# Altium project PaulInOne.PrjPcb
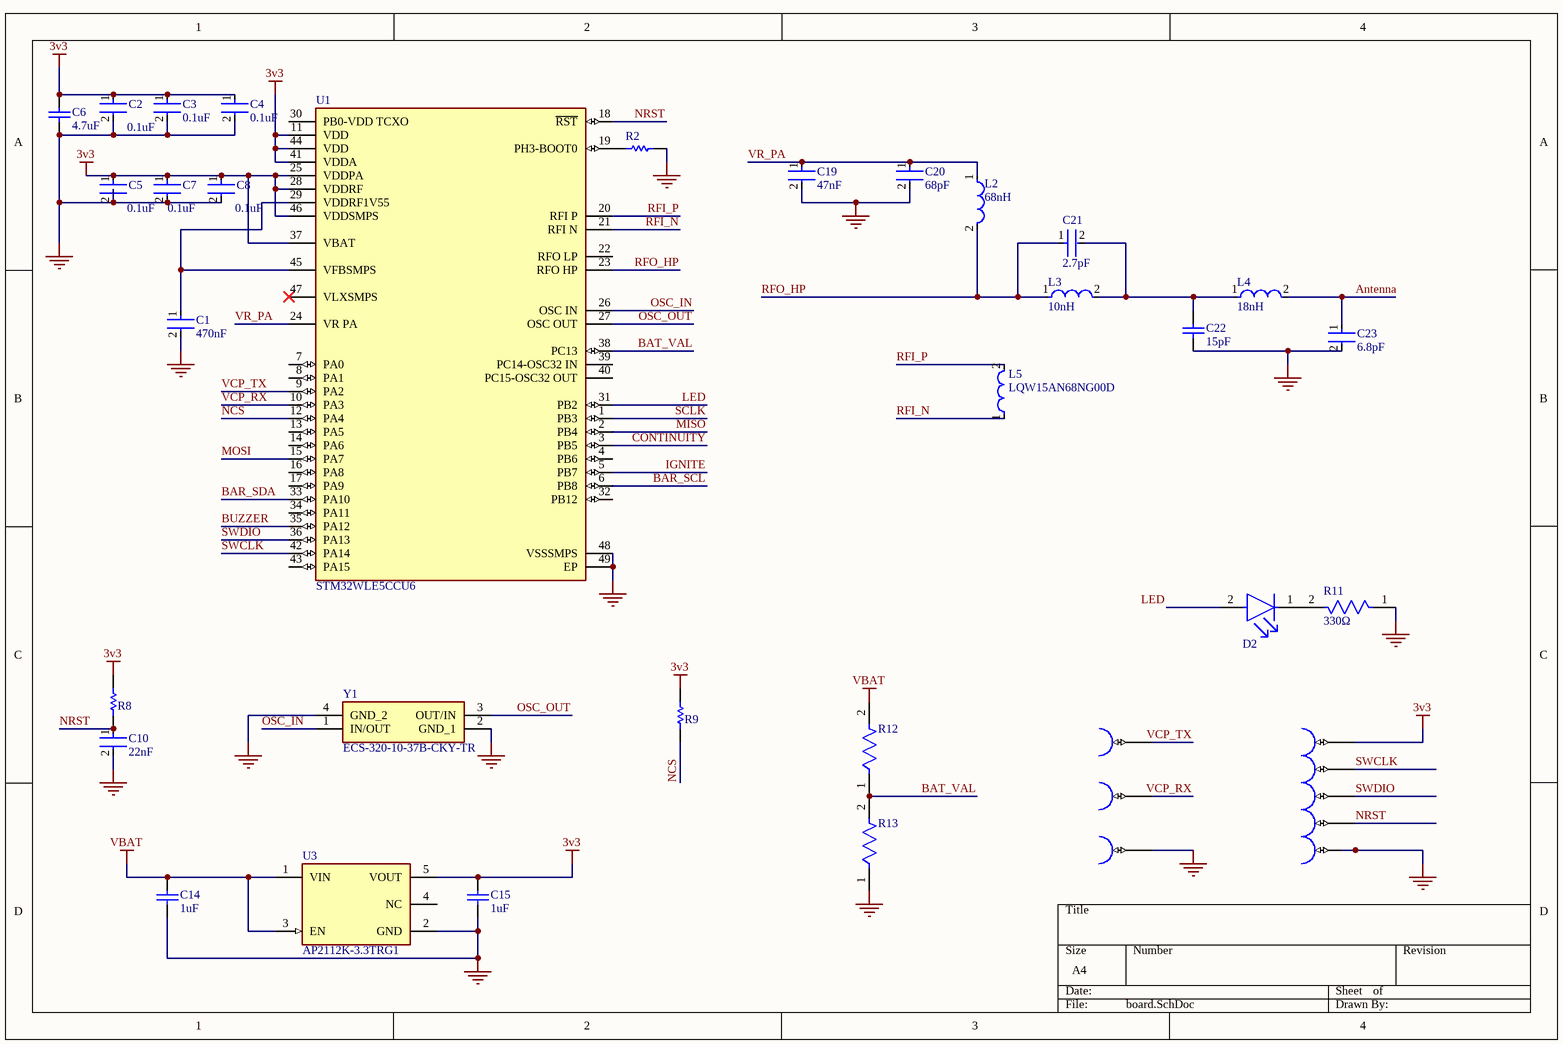
[diagram p0: board.SchDoc]
2 sheets, 56 parts. Net scope: global (net labels, ports and power ports of the same name join across sheets).
Board file: PCB_design.PcbDoc
Sheets:
  board.SchDoc
  MISC.SchDoc

## Sheet board.SchDoc
size A4; SheetNumber: 1; SheetTotal: 2

### Parts
C1  470nF  [FP-C0603C-CF-MFG]
C2  0.1uF  [FP-C0402-BB-MFG]
C3  0.1uF  [FP-C0402-BB-MFG]
C4  0.1uF  [FP-C0402-BB-MFG]
C5  0.1uF  [FP-C0402-BB-MFG]
C6  4.7uF  [CAPC1608X87X35NL15T15]
C7  0.1uF  [FP-C0402-BB-MFG]
C8  0.1uF  [FP-C0402-BB-MFG]
C10  22nF  [FP-C0402-BB-MFG]
C14  1uF  [C0603]
C15  1uF  [C0603]
C19  47nF  [FP-CC0402-MFG]
C20  68pF  [FP-C0402-BB-MFG]
C21  2.7pF  [FP-GJM155-0_05-IPC_A]
C22  15pF  [CAPC1005X55X25NL05T10]
C23  6.8pF  [FP-C0402-BB-MFG]
D2  LTST-C190GKT  [FP-LTST-C190GKT-MFG]  (value not drawn)
L2  68nH  [FP-LQW15AN_00-W0_5-0_1-MFG]
L3  10nH  [FP-LQW15AN_00-W0_6-0_1-MFG]
L4  18nH  [FP-LQW15AN_00-W0_6-0_1-MFG]
L5  LQW15AN68NG00D  [FP-LQW15AN_00-W0_5-0_1-MFG]
R2  ERJ2RKF1002X  [RESC1005X40X25LL05T05]  (value not drawn)
R8  ERJ2RKF1002X  [RESC1005X40X25LL05T05]  (value not drawn)
R9  ERJ3EKF1002V  [RESC1609X55X30LL15T15]  (value not drawn)
R11  330Ω  [FP-CRCW0402-e3-IPC_C]
R12  CRCW0402100KFKED  [FP-CRCW0402-e3-IPC_C]  (value not drawn)
R13  CRCW040250K0FKED  [FP-CRCW0402-e3-IPC_A]  (value not drawn)
TP1  Castellated Hole  [Castellated Hole]  (value not drawn)
TP2  Castellated Hole  [Castellated Hole]  (value not drawn)
TP3  Castellated Hole  [Castellated Hole]  (value not drawn)
TP4  Castellated Hole  [Castellated Hole]  (value not drawn)
TP5  Castellated Hole  [Castellated Hole]  (value not drawn)
TP6  Castellated Hole  [Castellated Hole]  (value not drawn)
TP7  Castellated Hole  [Castellated Hole]  (value not drawn)
TP8  Castellated Hole  [Castellated Hole]  (value not drawn)
U1  STM32WLE5CCU6  [FP-UFQFPN48-A0B9-IPC_C]
U3  AP2112K-3.3TRG1  [FP-SOT25-IPC_A]
Y1  ECS-320-10-37B-CKY-TR  [ECS3201037BCKYTR]

### Nets
3v3: C2.1 C3.1 C4.1 C5.1 C6.2 C7.1 C8.1 C15.2 R8.2 R9.2 TP1.1(Pin) U1.11(VDD) U1.25(VDDPA) U1.28(VDDRF) U1.37(VBAT) U1.41(VDDA) U1.44(VDD) U1.46(VDDSMPS) U3.5(VOUT)
GND: C1.2 C2.2 C3.2 C4.2 C5.2 C6.1 C7.2 C8.2 C10.2 C14.1 C15.1 C19.2 C20.2 C22.1 C23.2 R2.2 R11.1 R13.1 TP5.1(Pin) TP8.1(Pin) U1.48(VSSSMPS) U1.49(EP) U3.2(GND) Y1.2(GND_1) Y1.4(GND_2)
VBAT: C14.2 R12.2 U3.1(VIN) U3.3(EN)
Antenna: C23.1 L4.2
BAR_SCL: U1.6(PB8)
BAR_SDA: U1.33(PA10)
BAT_VAL: R12.1 R13.2 U1.38(PC13)
BUZZER: U1.35(PA12)
CONTINUITY: U1.3(PB5)
IGNITE: U1.5(PB7)
LED: D2.2(A) U1.31(PB2)
MISO: U1.2(PB4)
MOSI: U1.15(PA7)
NCS: R9.1 U1.12(PA4)
NRST: C10.1 R8.1 TP4.1(Pin) U1.18(~{RST})
OSC_IN: U1.26(OSC_IN) Y1.1(IN/OUT)
OSC_OUT: U1.27(OSC_OUT) Y1.3(OUT/IN)
RFI_N: L5.1 U1.21(RFI_N)
RFI_P: L5.2 U1.20(RFI_P)
RFO_HP: C21.1 L2.2 L3.1 U1.23(RFO_HP)
SCLK: U1.1(PB3)
SWCLK: TP2.1(Pin) U1.42(PA14)
SWDIO: TP3.1(Pin) U1.36(PA13)
VCP_RX: TP7.1(Pin) U1.10(PA3)
VCP_TX: TP6.1(Pin) U1.9(PA2)
VR_PA: C19.1 C20.1 L2.1 U1.24(VR_PA)
NetC1_1: C1.1 U1.29(VDDRF1V55) U1.45(VFBSMPS)
NetC21_2: C21.2 C22.2 L3.2 L4.1
NetD2_1: D2.1(C) R11.2
NetR2_1: R2.1 U1.19(PH3-BOOT0)

Not connected (* = marked no-connect by the designer): U1 4(PB6) 7(PA0) 8(PA1) 13(PA5) 14(PA6) 16(PA8) 17(PA9) 22(RFO_LP) 30(PB0-VDD_TCXO) 32(PB12) 34(PA11) 39(PC14-OSC32_IN) 40(PC15-OSC32_OUT) 43(PA15) 47(VLXSMPS)*; U3 4(NC)

### Library data of the parts
C1 = CMP-2006-03235-2: CAP CER 0.47UF 16V X7R 0603; Manufacturer Part Number: C0603C474K4RACTU; Manufacturer: KEMET; Automotive Grade: Grade 1; Value: 0.47 μF; Tolerance: 0.1; Temperature Coefficient: 30ppm/°C; Material: Ceramic; Device Class L3: Ceramic Capacitors; ComponentLink2URL: https://api.kemet.com/component-edge/download/datasheet/C0603C100J5GACAUTO.pdf; Height: 0.87mm; ComponentLink2Description: Datasheet; Device Class L2: Capacitors; Temperature Range Low: -55°C; Temperature Range High: +125°C; RoHS: TRUE; Mouser Description: 0603 C 470nF Ceramic Multilayer Capacitor, 16 V, +125degC, X7R Dielec, +/-10%; Temperature Characteristic: X7R; Digikey Description: CAP CER 0.47UF 16V X7R 0603; Lead Free: Yes; Automotive: Yes; Octopart: https://octopart.com/c0603c474k4ractu-kemet-109683; Capacitance: 0.47 μF; Package: C0603C-CF; Voltage Rating: 16 V; Device Class L1: Passive Components; Category: Cap; Temperature: -55°C to +125°C
C2-C5 C7 C8 = CMP-2008-02046-2: CAP CER 0.1UF 10V X5R 0402; Manufacturer: Kemet; Manufacturer Part Number: C0402C104K8PACTU; Material: Ceramic; Capacitance: 0.10 μF; Temperature Coefficient: 15%; Tolerance: 0.1; Value: 0.10 μF; Package: C0402-BB; Temperature: -55°C to +125°C; ComponentLink2Description: Datasheet; Temperature Characteristic: X5R; Device Class L1: Passive Components; Height: 0.55mm; Lead Free: Yes; ComponentLink2URL: https://content.kemet.com/datasheets/KEM_C1002_X7R_SMD.pdf; Device Class L2: Capacitors; Temperature Range Low: -55°C; Temperature Range High: +125°C; RoHS: TRUE; Octopart: https://octopart.com/c0402c104k8pactu-kemet-140039; Automotive: No; Mouser Description: Capacitor 100 nF 10 VDC 0402; Category: Cap; Voltage Rating: 10 V; Digikey Description: CAP CER 0.1UF 10V X5R 0402; Ipc Land Pattern Name: CAPC10050X50; Device Class L3: Ceramic Capacitors
C6 = CMP-2006-03238-1: Part Number: C0603C475K8PACTU; Manufacturer: Kemet
C10 = CMP-2008-03151-2: CAP CER 0.022UF 50V 10% X7R 0402; Manufacturer Part Number: C0402C223K5RACTU; Manufacturer: Kemet; Tolerance: 0.1; Temperature Coefficient: 15%; Capacitance: 22,000 pF; Material: Ceramic; Value: 22,000 pF; Lead Free: Yes; ComponentLink2URL: https://content.kemet.com/datasheets/KEM_C1002_X7R_SMD.pdf; Category: Cap; Digikey Description: CAP CER 0.022UF 50V 10% X7R 0402; Mouser Description: 0402 C 22nF Ceramic Multilayer Capacitor, 50 V, +125degC, X7R Dielectric, +/-10%; Temperature: -55°C to +125°C; Temperature Range High: +125°C; Device Class L3: Ceramic Capacitors; Device Class L1: Passive Components; Height: 0.55mm; Package: C0402-BB; Octopart: https://octopart.com/c0402c223k5ractu-kemet-99241; Temperature Range Low: -55°C; Voltage Rating: 50 V; Ipc Land Pattern Name: CAPC10050X50; ComponentLink2Description: Datasheet; Automotive: No; Temperature Characteristic: X7R; RoHS: TRUE; Device Class L2: Capacitors
C14 C15 = CMP-00121-2: CAP CER 1UF 50V X7R 0603; Made by: Victor Gutierrez; Design Item ID: CC0603KRX7R9BB105; Source: Capacitors.SchLib
C19 = CMP-03422-000813-1: CAP CER 0.047UF 25V X7R 0402; Manufacturer Part Number: CC0402KRX7R8BB473; Manufacturer: YAGEO; Automotive Grade: NA; Temperature Coefficient: 30ppm/°C; Material: Ceramic; Tolerance: 0.1; Temperature: -55°C to +125°C; Category: Cap; Voltage Rating: 25 V; Digikey Description: CAP CER 0.047UF 25V X7R 0402; Device Class L1: Passive Components; Device Class L3: Ceramic Capacitors; Ipc Land Pattern Name: CAPC10050X50; Value: 47 nF; Temperature Characteristic: X7R; Temperature Range High: +125°C; ComponentLink2URL: http://www.yageo.com/documents/recent/UPY-GP_NP0_16V-to-50V_16.pdf; Automotive: No; Temperature Range Low: -55°C; Package: CC0402; RoHS: TRUE; Height: 0.55mm; Device Class L2: Capacitors; Capacitance: 47 nF; Octopart: https://octopart.com/cc0402krx7r8bb473-yageo-22850998; Lead Free: Yes; Mouser Description: Multilayer Ceramic Capacitors MLCC - SMD/SMT 47nF 25V X7R 10%; Footprint Url: http://www.yageo.com/exep/pages/download/literatures/UPY-C_GEN_24.pdf; ComponentLink2Description: Datasheet
C20 = CMP-1034-01170-4: CAP CER 68PF 50V 5% NP0 0402; Manufacturer: Kemet; Manufacturer Part Number: C0402C680J5GACTU; Temperature Coefficient: 15%; Tolerance: 0.05; Temperature Characteristic: C0G; Material: Ceramic; Mouser Description: Multilayer Ceramic Capacitors MLCC - SMD/SMT 50volts 68pF C0G 5%; Package: C0402-BB; Automotive: No; Temperature: -55°C to +125°C; RoHS: TRUE; Category: Cap; Capacitance: 68 pF; Value: 68 pF; Height: 0.55mm; Lead Free: Yes; Device Class L1: Passive Components; Voltage Rating: 50 V; Device Class L2: Capacitors; Device Class L3: Ceramic Capacitors; ComponentLink2Description: Datasheet; Temperature Range High: +125°C; Octopart: https://octopart.com/c0402c680j5gactu-kemet-127205; ComponentLink2URL: https://content.kemet.com/datasheets/KEM_C1002_X7R_SMD.pdf; Digikey Description: CAP CER 68PF 50V 5% NP0 0402; Temperature Range Low: -55°C; Ipc Land Pattern Name: CAPC10050X50
C21 = CMP-2008-03840-2: Multi-Layer Ceramic Capacitor 2.7pF C0G  ±0.1pF 0402 Paper T/R; Voltage Rating (DC): 50V; Temperature Coefficient: 30ppm/°C; Max Operating Temperature: 125°C; Lead Free: Lead Free; REACH SVHC: No SVHC; Thickness: 0.022inch; Length: 1mm; Height: 0.5mm; Min Operating Temperature: -55°C; Mount: Surface Mount; Case/Package: 0402; Case Code (Imperial): 0402; Width: 0.02inch; Capacitance: 2.7pF; Packaging: Tape and Reel; Package Quantity: 10000; Lead Pitch: 0.3mm; Dielectric: C0G; Depth: 0.5mm; Voltage Rating: 50V; Radiation Hardening: No; Termination: SMD/SMT; Voltage: 50V; Number of Pins: 2; Case Code (Metric): 1005
C22 = CMP-2008-04267-1: Part Number: GRM1555C1H150JZ01D; Manufacturer: Murata
C23 = CMP-1034-00517-3: CAP CER 6.8PF 50V NP0 0402; Manufacturer: Kemet; Manufacturer Part Number: C0402C689C5GACTU; Material: Ceramic; Temperature Characteristic: C0G; Tolerance: 0.25 pF; Temperature Coefficient: 15%; ComponentLink2URL: https://content.kemet.com/datasheets/KEM_C1002_X7R_SMD.pdf; Octopart: https://octopart.com/c0402c689c5gactu-kemet-9143567; RoHS: TRUE; Temperature: -55°C to +125°C; Device Class L2: Capacitors; ComponentLink2Description: Datasheet; Mouser Description: Cap Ceramic 6.8pF 50V C0G 0.25pF SMD 0402 125°C Paper T/R; Device Class L3: Ceramic Capacitors; Digikey Description: CAP CER 6.8PF 50V NP0 0402; Temperature Range High: +125°C; Package: C0402-BB; Voltage Rating: 50 V; Height: 0.55mm; Ipc Land Pattern Name: CAPC10050X50; Value: 6.8 pF; Device Class L1: Passive Components; Category: Cap; Capacitance: 6.8 pF; Lead Free: Yes; Automotive: No; Temperature Range Low: -55°C
D2 = CMP-22017-000005-2: LED GREEN CLEAR CHIP SMD; Dominant Wavelength: 569nm; Reverse Voltage: 5V; Lens Color: Colorless; Viewing Angle: 130°; Voltage: 2V; Forward Current: 30mA; Power Dissipation: 100mW; Luminous Intensity: 6mcd; Number of LEDs: 1; Forward Voltage: 2.1V; Wavelength: 565nm; Test Current: 10mA; Min Operating Temperature: -55°C; Lens Style: Clear; Mount: Surface Mount; Width: 0.8mm; Packaging: Tape and Reel; Lens Transparency: Clear; Case Code (Metric): 1608; Depth: 0.8mm; Case Code (Imperial): 0603; Case/Package: 0603; Number of Pins: 2; Max Operating Temperature: 85°C; Lead Free: Lead Free; Number of Elements: 1; Length: 1.6mm; Height: 0.8mm; Package Quantity: 1; Power Rating: 100mW; Radiation Hardening: No; Illumination Color: Green; Color: Green
L2 L5 = CMP-06042-005746-1: Wire Wound RF Inductor 68nH ±2% 140mA 1.96Ω 0402 (1005); Core Material: Air; DC Resistance (DCR): 1.96R; Q Factor: 20; Shielding: Unshielded; Test Frequency: 100MHz; Current: 570mA; Self Resonant Frequency: 2.5GHz; Max Operating Temperature: 125°C; Depth: 0.6mm; Case Code (Metric): 1005; Tolerance: 2%; Weight: 2.8E-05oz; Width: 0.5mm; Case/Package: 0402; Termination: SMD/SMT; Height: 0.5mm; Lead Free: Lead Free; Mount: Surface Mount; Length: 1mm; Number of Pins: 2; Min Operating Temperature: -55°C; Inductance: 68nH; Case Code (Imperial): 0402; Packaging: Tape and Reel; Inductance Tolerance: 2%; Current Rating: 140mA; Package Quantity: 10000; DC Current: 140mA; Max DC Current: 140mA; Military Standard: Not; Radiation Hardening: No; REACH SVHC: No SVHC
L3 = CMP-06042-002082-1: Wire Wound RF Inductor 10nH ±2% 500mA 0.17Ω 0402 (1005); Shielding: Unshielded; DC Resistance (DCR): 170mR; Test Frequency: 100MHz; Current: 370mA; Core Material: Non-Magnetic; Self Resonant Frequency: 5.5GHz; Tolerance: 2%; Depth: 0.7mm; Lead Free: Lead Free; Termination: SMD/SMT; Case Code (Imperial): 0402; Height - Seated (Max): 0.024inch; Package Quantity: 10000; Packaging: Tape and Reel; Case/Package: 0402; REACH SVHC: No SVHC; Length: 1mm; Weight: 2.8E-05oz; Resistor Type: Wirewound; Number of Pins: 2; Mount: Surface Mount; DC Current: 500mA; Max Operating Temperature: 125°C; Case Code (Metric): 1005; Width: 0.02inch; Max DC Current: 500mA; Inductance: 10nH; Radiation Hardening: No; Height: 0.5mm; Current Rating: 500mA; Min Operating Temperature: -55°C; Military Standard: Not; Inductance Tolerance: 2%
L4 = CMP-06042-006916-1: Wire Wound RF Inductor 18nH ±5% 370mA 0.27Ω 0402 (1005); Q Factor: 25; DC Resistance (DCR): 270mR; Test Frequency: 100MHz; Self Resonant Frequency: 4.5GHz; Core Material: Air; Shielding: Unshielded; Inductance: 18nH; Lead Free: Lead Free; Resistor Type: Wirewound; Height: 0.5mm; Width: 0.02inch; Max DC Current: 370mA; Case/Package: 0402; Radiation Hardening: No; Min Operating Temperature: -55°C; Packaging: Tape and Reel; DC Current: 370mA; Tolerance: 5%; Max Operating Temperature: 125°C; Weight: 2.8E-05oz; Current Rating: 370mA; Military Standard: Not; Termination: SMD/SMT; Length: 1mm; Case Code (Metric): 1005; Mount: Surface Mount; Case Code (Imperial): 0402; Package Quantity: 10000; Depth: 0.7mm
R2 R8 = CMP-2000-07588-1: Chip Resistor, 10 KOhm, +/- 1%, 0.1 W, -55 to 155 degC, 0402 (1005 Metric), RoHS, Tape and Reel; Manufacturer: Panasonic; Power Rating: 100mW; Voltage Rating: 50V; Resistance: 10KOhm; Case\/Package: 0402; Temperature Coefficient: 100ppm\/degreesC; RoHSCompliant: True; Lead Free: LeadFree; Package Quantity: 1; Contact Plating: Tin; Length: 1mm; Radiation Hardening: No; REACH SVHC: NoSVHC; Max Operating Temperature: 155degC; Depth: 0.5mm; Case Code (Imperial): 0402; Military Standard: Not; Package Description: 2-Pin Surface Mount Device, Body 1 x 0.5 mm; Termination: SMD/SMT; Case Code (Metric): 1005; Height: 0.35mm; Packaging: TapeandReel; Voltage Rating (DC): 50V; Package Reference: 402; Number of Pins: 2; Tolerance: 1%; Mounting Technology: SurfaceMount; Width: 0.02inch; Mount: SurfaceMount; Datasheet URL: https://industrial.panasonic.com/cdbs/www-data/pdf/RDA0000/AOA0000C304.pdf; Composition: ThickFilm; Datasheet Version: 02/2017; Manufacturer URL: http://www.panasonic.com/; Max Power Dissipation: 100mW; Number of Terminations: 2; Min Operating Temperature: -55degC
R9 = CMP-1012-00623-3: Chip Resistor, 10 KOhm, +/- 1%, 0.1 W, -55 to 155 degC, 0603 (1608 Metric), RoHS, Tape and Reel; Manufacturer: Panasonic; Voltage Rating: 75V; Case\/Package: 0603; Power Rating: 100mW; Resistance: 10KOhm; Temperature Coefficient: 100ppm\/degreesC; Number of Pins: 2; Package Reference: 603; Depth: 0.8mm; Mount: SurfaceMount; Package Description: 2-Pin Surface Mount Device, Body 1.6 x 0.85 mm; Datasheet Version: 02/2017; Length: 1.6mm; Lead Free: LeadFree; Height: 0.45mm; Number of Terminations: 2; Max Power Dissipation: 100mW; Min Operating Temperature: -55degC; Datasheet URL: https://industrial.panasonic.com/cdbs/www-data/pdf/RDA0000/AOA0000C304.pdf; Termination: SMD/SMT; Case Code (Metric): 1608; Case Code (Imperial): 0603; Tolerance: 1%; Max Operating Temperature: 155degC; RoHSCompliant: true; Voltage Rating (DC): 75V; Radiation Hardening: No; Packaging: TapeandReel; Composition: ThickFilm; Mounting Technology: SurfaceMount; Manufacturer URL: http://www.panasonic.com/; Width: 0.031inch; REACH SVHC: NoSVHC; Contact Plating: Tin; Military Standard: Not; Package Quantity: 1
R11 = CMP-2002-08122-2: RES Thick Film, 0Ω, 0.063W, 0402; Tolerance: 5%; Max Power Dissipation: 63mW; Voltage Rating: 50V; Temperature Coefficient: 100ppm/°C; Resistance: 0mR; Contact Plating: Tin; Height: 0.35mm; Radiation Hardening: No; Features: Automotive AEC-Q200; Composition: Thick Film; Width: 0.5mm; Weight: 2.3E-05oz; Termination: SMD/SMT; Packaging: Tape and Reel; Mount: Surface Mount; Case Code (Metric): 1005; Military Standard: Not; Min Operating Temperature: -55°C; Number of Terminations: 2; Package Quantity: 1; Case Code (Imperial): 0402; Depth: 0.5mm; Max Operating Temperature: 155°C; Case/Package: 0402; Power Rating: 63mW; Lead Free: Lead Free; Voltage Rating (DC): 50V; Length: 1mm
R12 = CMP-2002-08123-3: RES Thick Film, 100kΩ, 1%, 0.063W, 100ppm/°C, 0402; Power Rating: 63mW; Resistance: 100kR; Voltage Rating (DC): 50V; Lead Free: Lead Free; Height: 0.35mm; Contact Plating: Tin; Min Operating Temperature: -55°C; Package Quantity: 10000; Case/Package: 0402; Temperature Coefficient: 100ppm/°C; Number of Terminations: 2; Packaging: Tape and Reel; Max Power Dissipation: 63mW; Case Code (Metric): 1005; Mount: Surface Mount; Width: 0.02inch; Termination: SMD/SMT; Length: 1mm; Number of Pins: 2; Weight: 2.3E-05oz; Radiation Hardening: No; Tolerance: 1%; Military Standard: Not; Features: Automotive AEC-Q200; Depth: 0.5mm; Composition: Thick Film; Max Operating Temperature: 155°C; Voltage Rating: 50V; Case Code (Imperial): 0402
R13 = CMP-02407-005152-1: RES Thick Film, 50kΩ, 1%, 0.063W, 100ppm/°C, 0402; Power Rating: 63mW; Voltage Rating: 50V; Resistance: 50kR; Package Quantity: 10000; Case/Package: 0402; Max Operating Temperature: 155°C; Case Code (Metric): 1005; Termination: SMD/SMT; Lead Free: Lead Free; Height: 0.35mm; Width: 0.5mm; Packaging: Tape and Reel; Min Operating Temperature: -55°C; Length: 1mm; Tolerance: 1%; Case Code (Imperial): 0402; Weight: 2.3E-05oz
TP1-TP8 = CMP-00124-3: Castellated Hole, 1 connection
U1 = CMP-12105-000100-1: MULTIPROTOCOL LPWAN 32-BIT ARM C
U3 = CMP-12756-000035-1: IC REG LINEAR 3.3V 600MA SOT25; Number of Regulators: 1; Output Type: Fixed; Polarity: Positive; Min Input Voltage: 2.5V; Max Input Voltage: 6V; Accuracy: 1.5%; Quiescent Current: 55uA; Dropout Voltage: 250mV; Min Operating Temperature: -40°C; Length: 3.1mm; Output Current: 600mA; Max Operating Temperature: 85°C; Package Quantity: 1; Output Voltage: 3.3V; Width: 1.7mm; Number of Outputs: 1; Packaging: Tape and Reel; Height: 1.3mm; Lead Free: Lead Free; Max Output Current: 600mA; Case/Package: SOT-23-5; Mount: Surface Mount; Number of Pins: 5
Y1 = ECS-320-10-37B-CKY-TR: Crystal or Oscillator; Manufacturer_Name: ECS; Datasheet Link: https://ecsxtal.com/store/pdf/ECX-1637B.pdf; Height: 0.5mm; Manufacturer_Part_Number: ECS-320-10-37B-CKY-TR; Mouser Part Number: 520-320-10-37B-CKYT; Mouser Price/Stock: https://www.mouser.co.uk/ProductDetail/ECS/ECS-320-10-37B-CKY-TR?qs=l7cgNqFNU1gltxVt%2FwcX%252Bw%3D%3D; Arrow Part Number: ECS-320-10-37B-CKY-TR; Arrow Price/Stock: https://www.arrow.com/en/products/ecs-320-10-37b-cky-tr/ecs-international?region=nac

## Sheet MISC.SchDoc
size A4; SheetNumber: 2; SheetTotal: 2
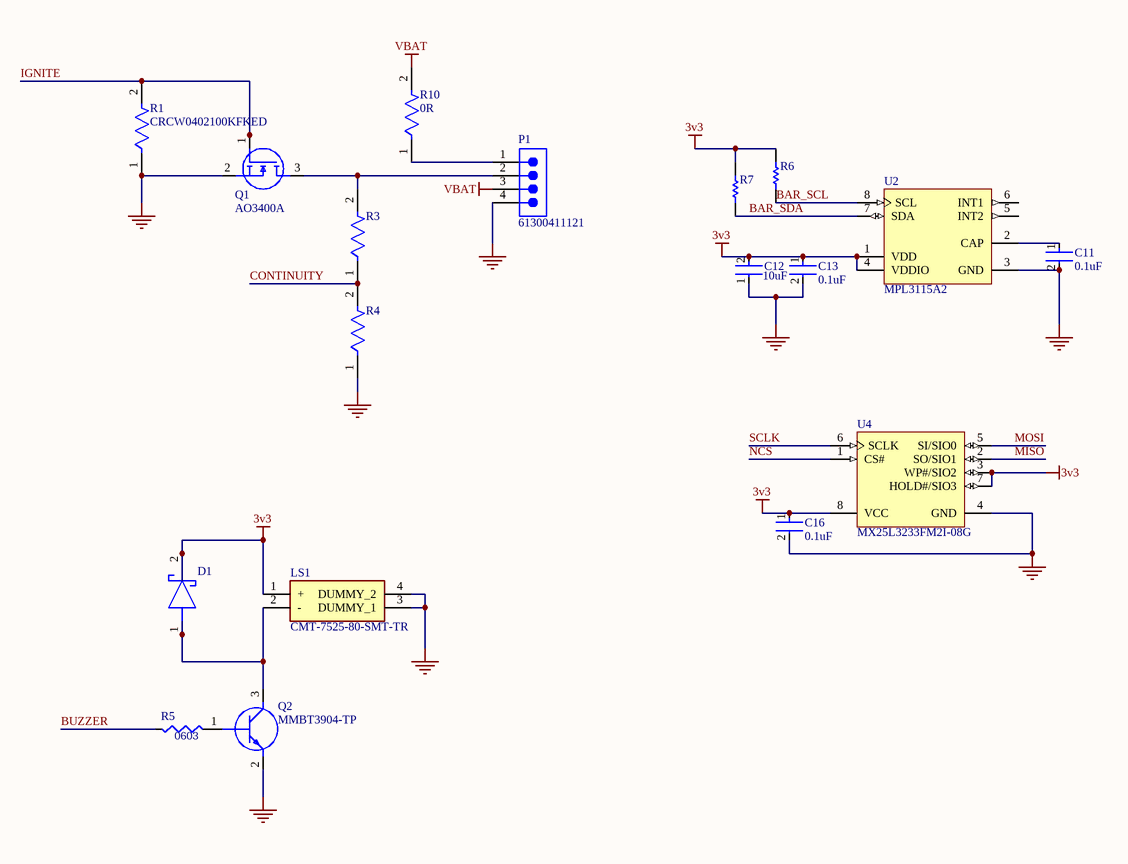
[diagram p1: MISC.SchDoc]

### Parts
C11  0.1uF  [FP-C0402-BB-MFG]
C12  10uF  [FP-C1608-080-0_1-MFG]
C13  0.1uF  [FP-C0402-BB-MFG]
C16  0.1uF  [FP-C0402-BB-MFG]
D1  RB161QS-40T18R  [RB161QS40T18R]  (value not drawn)
LS1  CMT-7525-80-SMT-TR  [CMT752580SMTTR]
P1  61300411121  [61300411121]
Q1  AO3400A  [SOT95P280X125-3N]
Q2  MMBT3904-TP  [SOT95P237X125-3N]
R1  CRCW0402100KFKED  [FP-CRCW0402-e3-IPC_C]
R3  CRCW0402100KFKED  [FP-CRCW0402-e3-IPC_C]  (value not drawn)
R4  CRCW040250K0FKED  [FP-CRCW0402-e3-IPC_A]  (value not drawn)
R5  ERJ-3EKF2000V  [R0603]  (value not drawn)
R6  RC0402JR-074K7L  [RESC1005X40X25LL05T10]  (value not drawn)
R7  RC0402JR-074K7L  [RESC1005X40X25LL05T10]  (value not drawn)
R10  0R  [FP-RK73Z1J-MFG]
U2  MPL3115A2  [FRES-2153-01_V]
U4  MX25L3233FM2I-08G  [MXIC-SOP-8_M]

### Nets
3v3: C12.2 C13.1 C16.1 D1.2(K) LS1.1(+) R6.2 R7.2 U2.1(VDD) U2.4(VDDIO) U4.3(WP#/SIO2) U4.7(HOLD#/SIO3) U4.8(VCC)
GND: C11.2 C12.1 C13.2 C16.2 LS1.3(DUMMY_1) LS1.4(DUMMY_2) P1.4 Q1.2(S) Q2.2(E) R1.1 R4.1 U2.3(GND) U4.4(GND)
VBAT: P1.3 R10.2
BAR_SCL: R6.1 U2.8(SCL)
BAR_SDA: R7.1 U2.7(SDA)
BUZZER: R5.1
CONTINUITY: R3.1 R4.2
IGNITE: Q1.1(G) R1.2
MISO: U4.2(SO/SIO1)
MOSI: U4.5(SI/SIO0)
NCS: U4.1(CS#)
SCLK: U4.6(SCLK)
NetC11_1: C11.1 U2.2(CAP)
NetD1_1: D1.1(A) LS1.2(-) Q2.3(C)
NetP1_1: P1.1 R10.1
NetP1_2: P1.2 Q1.3(D) R3.2
NetQ2_1: Q2.1(B) R5.2

Not connected (* = marked no-connect by the designer): U2 5(INT2) 6(INT1)

### Notes on the sheet
- (in symbol CMP-024-000031-1) 0603

### Library data of the parts
C11 C13 C16 = CMP-2008-02046-2: as C2 on sheet board; Package: C0402-BB; Temperature: -55°C to +125°C; ComponentLink2Description: Datasheet; Temperature Characteristic: X5R; Device Class L1: Passive Components; Height: 0.55mm; Lead Free: Yes; ComponentLink2URL: https://content.kemet.com/datasheets/KEM_C1002_X7R_SMD.pdf; Device Class L2: Capacitors; Temperature Range Low: -55°C; Temperature Range High: +125°C; RoHS: TRUE; Octopart: https://octopart.com/c0402c104k8pactu-kemet-140039; Automotive: No; Mouser Description: Capacitor 100 nF 10 VDC 0402; Category: Cap; Voltage Rating: 10 V; Digikey Description: CAP CER 0.1UF 10V X5R 0402; Ipc Land Pattern Name: CAPC10050X50; Device Class L3: Ceramic Capacitors
C12 = CMP-2000-04979-3: Multilayer Ceramic Capacitors 10μF ±10% 10V X5R SMD 0603; Dielectric Material: Ceramic; Construction: Flat; Height: 0.8mm; Thickness: 0.035inch; Case Code (Metric): 1608; Radiation Hardening: No; Number of Pins: 2; Voltage Rating (DC): 10V; Depth: 0.8mm; Voltage: 10V; RoHS Compliant: Yes; Voltage Rating: 10V; Package Quantity: 1; Resistor Type: Ceramic; Termination: SMD/SMT; Lead Free: Lead Free; REACH SVHC: No SVHC; Tolerance: 10%; Mount: Surface Mount; Series: C; Packaging: Tape and Reel; Width: 0.8mm; Dielectric: X5R; Weight: 7.1E-05oz; Length: 1.6mm; Max Operating Temperature: 85°C; Case Code (Imperial): 0603; Case/Package: 0603; Min Operating Temperature: -55°C; Capacitance: 10uF
D1 = RB161QS-40T18R: Schottky Diode; Manufacturer_Name: ROHM Semiconductor; Datasheet Link: http://rohmfs.rohm.com/en/products/databook/datasheet/discrete/diode/schottky_barrier/rb161qs-40-e.pdf; Height: 0.24mm; Manufacturer_Part_Number: RB161QS-40T18R; Mouser Part Number: 755-RB161QS-40T18R; Mouser Price/Stock: https://www.mouser.co.uk/ProductDetail/ROHM-Semiconductor/RB161QS-40T18R?qs=r%2Fl4stf1ffr06ghBFd2HSg%3D%3D
LS1 = CMT-7525-80-SMT-TR: Loudspeaker or Buzzer; Manufacturer_Name: CUI Devices; Datasheet Link: https://www.cuidevices.com/product/resource/cmt-7525-80-smt-tr.pdf; Height: 2.7mm; Manufacturer_Part_Number: CMT-7525-80-SMT-TR; Mouser Part Number: 490-CMT-7525-80SMTTR; Mouser Price/Stock: https://www.mouser.co.uk/ProductDetail/CUI-Devices/CMT-7525-80-SMT-TR?qs=P1JMDcb91o5izP7Xira9ww%3D%3D; Arrow Part Number: CMT-7525-80-SMT-TR; Arrow Price/Stock: https://www.arrow.com/en/products/cmt-7525-80-smt-tr/cui-devices?region=nac
P1 = CMP-1502-01064-3: NexarPartId: 32855522; Operating Supply Voltage: 250V; Pitch: 2.54mm; Contact Resistance: 20mΩ; Number of Positions: 4; Current Rating: 3A; Connector Type: Male Pin; Gender: Male; Contact Plating: Gold; Height: 8.89mm; Lead Pitch: 2.54mm; Lead Free: Lead Free; Contact Mating Length: 5.9944mm; Number of Rows: 1; Termination: Solder; Packaging: Bulk; REACH SVHC: Unknown; Min Operating Temperature: -40°C; RoHS: Compliant; Number of Contacts: 4; Voltage Rating: 250V; Color: Black; Max Operating Temperature: 105°C; Contact Material: Copper; Mount: Through Hole; Orientation: Vertical; Number of Pins: 4
Q1 = AO3400A: MOSFET (N-Channel); Manufacturer_Name: Alpha & Omega Semiconductors; Datasheet Link: http://aosmd.com/res/data_sheets/AO3400A.pdf; Height: 1.25mm; Manufacturer_Part_Number: AO3400A; Arrow Part Number: AO3400A; Arrow Price/Stock: https://www.arrow.com/en/products/ao3400a/alpha-and-omega-semiconductor?utm_currency=USD&region=nac
Q2 = MMBT3904-TP: Transistor BJT NPN; Manufacturer_Name: MCC; Datasheet Link: https://mccsemi.com/pdf/Products/MMBT3904(SOT-23).pdf; Height: 1.25mm; Manufacturer_Part_Number: MMBT3904-TP; Mouser Part Number: 833-MMBT3904-TP; Mouser Price/Stock: https://www.mouser.co.uk/ProductDetail/Micro-Commercial-Components-MCC/MMBT3904-TP?qs=KFo7JewZbUHicjDjIayULQ%3D%3D; Arrow Part Number: MMBT3904-TP; Arrow Price/Stock: https://www.arrow.com/en/products/mmbt3904-tp/micro-commercial-components?region=nac
R1 R3 = CMP-2002-08123-3: as R12 on sheet board; Lead Free: Lead Free; Height: 0.35mm; Contact Plating: Tin; Min Operating Temperature: -55°C; Package Quantity: 10000; Case/Package: 0402; Temperature Coefficient: 100ppm/°C; Number of Terminations: 2; Packaging: Tape and Reel; Max Power Dissipation: 63mW; Case Code (Metric): 1005; Mount: Surface Mount; Width: 0.02inch; Termination: SMD/SMT; Length: 1mm; Number of Pins: 2; Weight: 2.3E-05oz; Radiation Hardening: No; Tolerance: 1%; Military Standard: Not; Features: Automotive AEC-Q200; Depth: 0.5mm; Composition: Thick Film; Max Operating Temperature: 155°C; Voltage Rating: 50V; Case Code (Imperial): 0402
R4 = CMP-02407-005152-1: as R13 on sheet board; Package Quantity: 10000; Case/Package: 0402; Max Operating Temperature: 155°C; Case Code (Metric): 1005; Termination: SMD/SMT; Lead Free: Lead Free; Height: 0.35mm; Width: 0.5mm; Packaging: Tape and Reel; Min Operating Temperature: -55°C; Length: 1mm; Tolerance: 1%; Case Code (Imperial): 0402; Weight: 2.3E-05oz
R5 = CMP-024-000031-1: 200 OHM 1% 1/10W 0603; Made By: Brennan Swanton; Design Item ID: ERJ-3EKF2000V; Source: Resistors.SchLib; Reviewed By: *
R6 R7 = CMP-2002-08011-1: Manufacturer: Yageo / Phycomp; Part Number: RC0402JR-074K7L
R10 = CMP-2000-01769-2: RES 0 OHM JUMPER 0603; Resistance: 0mR; Power Rating: 1W; Tolerance: 1%; Temperature Coefficient: 400ppm/°C; Width: 0.8mm; Case/Package: 0603; RoHS Compliant: Yes; Min Operating Temperature: -55°C; Length: 1.6mm; Termination: SMD/SMT; Package Quantity: 5000; Packaging: Tape and Reel; Military Standard: Not; Series: RK73Z; Construction: Rectangular; Case Code (Metric): 1608; Resistor Type: Thick Film; Case Code (Imperial): 0603; Lead Free: Lead Free; Max Operating Temperature: 155°C; Depth: 0.8mm; Height: 0.45mm
U2 = CMP-1261-00002-2: Xtrinsic I2C Precision Altimeter, 1.95 to 3.6 V, -40 to 85 degC, 8-Pin LGA (2153-01), RoHS, Tray; Manufacturer: Freescale Semiconductor; fSCL@400 pF: 400 KHz Max.; VDDIO: 1.62 to 3.6 V; fSCL@20 pF: 4 MHz Max.; Operating Temperature Range: -40 to 85 degC; PackageDescription: 8-Pin Land Grid Array, Body 5 x 3 mm, Pitch 1.25 mm; Packing: Tray; ComponentLink1Description: Manufacturer URL; ComponentLink2Description: Datasheet; ComponentLink3URL: http://cache.freescale.com/files/shared/doc/package_info/98ASA00260D.pdf; RoHS: TRUE; Mounting Technology: Surface Mount; ComponentLink3Description: Package Specification; VDD: 1.95 to 3.6 V; ComponentLink1URL: http://www.freescale.com/; DatasheetVersion: Rev. 3.0; PartNumber: MPL3115A2; ComponentLink2URL: http://cache.freescale.com/files/sensors/doc/data_sheet/MPL3115A2.pdf; PackageVersion: Rev. O
U4 = CMP-2000-05278-1: CMOS MXSMIO(R) (Serial Multi I/O) Flash Memory, 32 Mbits (x1/x2/x4), 3 V, -40 to 85 degC, 8-Pin SOP; Manufacturer: Macronix; Manufacturer URL: http://www.macronix.com; Package Description: 8-Pin Small Outline Package, Body 5.23 x 5.28 mm, Pitch 1.27 mm; Datasheet URL: http://datasheet.octopart.com/MX25L3233FM2I-08G-Macronix-datasheet-38883555.pdf; Datasheet Version: Rev. 1.1, 01/2015; Package Reference: SOP-8

## Nets that join several sheets
3v3: board (19 pins), MISC (12 pins)
GND: board (25 pins), MISC (13 pins)
VBAT: board (C14.2 R12.2 U3.1 U3.3), MISC (P1.3 R10.2)
BAR_SCL: board (U1.6), MISC (R6.1 U2.8)
BAR_SDA: board (U1.33), MISC (R7.1 U2.7)
BUZZER: board (U1.35), MISC (R5.1)
CONTINUITY: board (U1.3), MISC (R3.1 R4.2)
IGNITE: board (U1.5), MISC (Q1.1 R1.2)
MISO: board (U1.2), MISC (U4.2)
MOSI: board (U1.15), MISC (U4.5)
NCS: board (R9.1 U1.12), MISC (U4.1)
SCLK: board (U1.1), MISC (U4.6)